# Altium schematic sheet 18650 charge.SchDoc
size A4
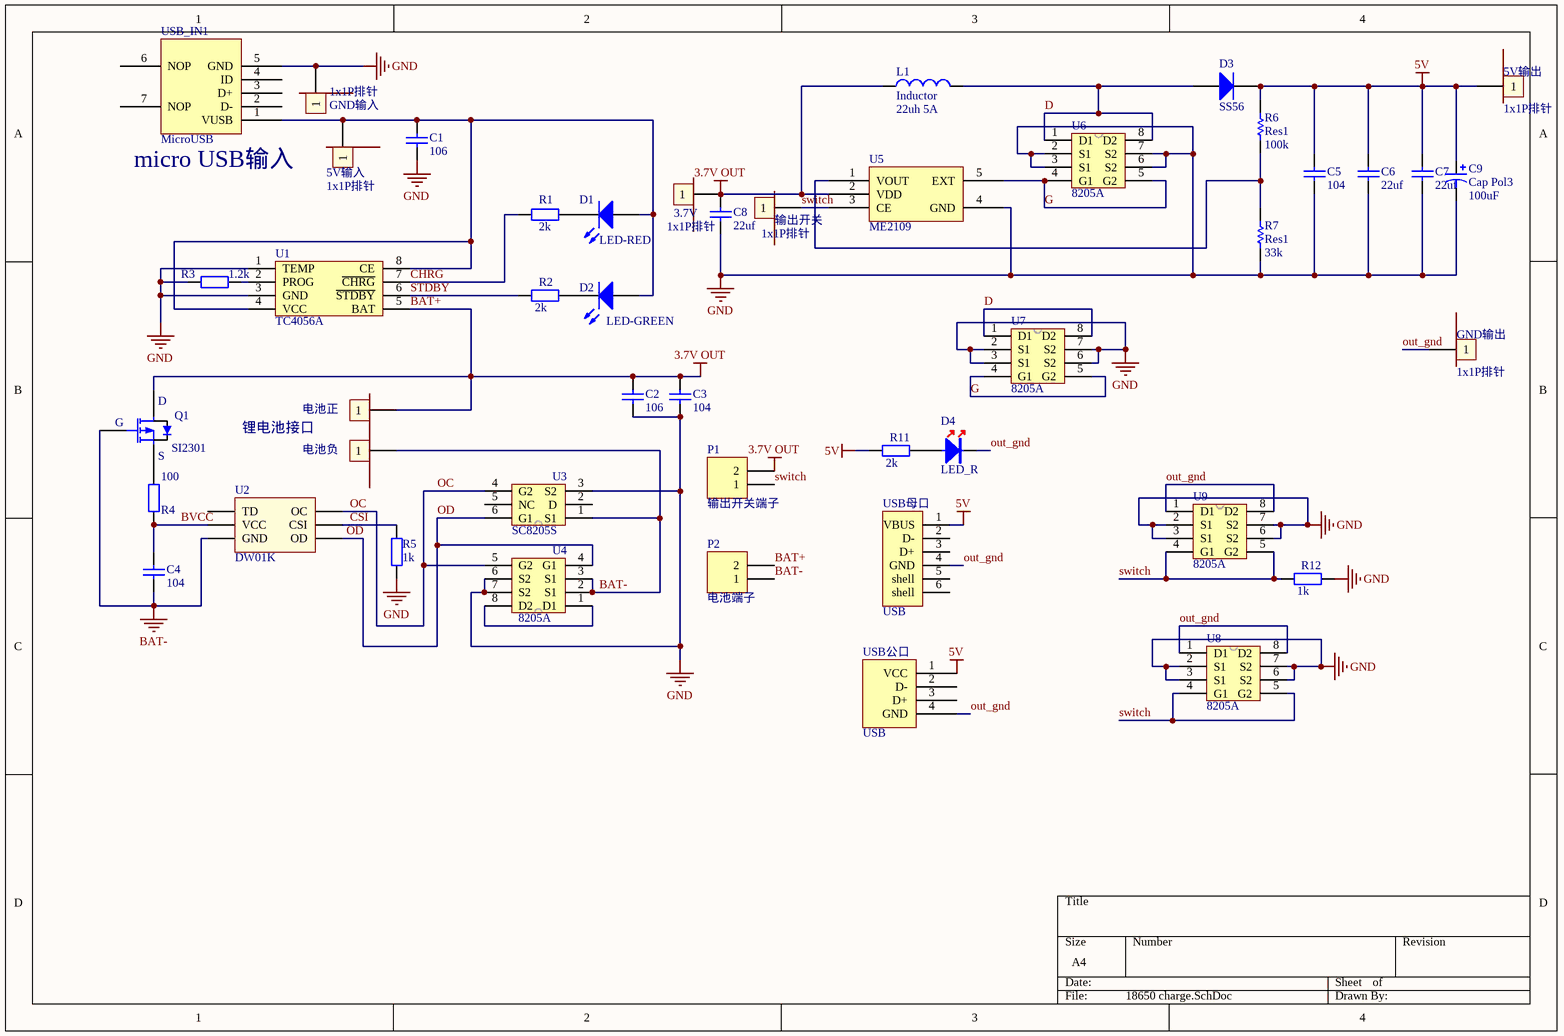
[diagram p0: 18650 charge.SchDoc]

## Parts
3.7V  1x1P排针  [HDR1B]
5V输入  1x1P排针  [HDR1B]
5V输出  1x1P排针  [HDR1B]
C1  106  [0805C]
C2  106  [0805C]
C3  104  [0805C]
C4  104  [0805C]
C5  104  [0805C]
C6  22uf  [0805C]
C7  22uf  [0805C]
C8  22uf  [0805C]
C9  Cap Pol3  value 100uF  [100uf youxin]
D1  LED-RED  [0603LED]
D2  LED-GREEN  [0603LED]
D3  SS56  [SMC(DO-214AB)]
D4  LED_R  [6-0805_M]
GND输入  1x1P排针  [HDR1B]
GND输出  1x1P排针  [HDR1B]
L1  Inductor  value 22uh 5A  [L1110]
P1  输出开关端子  [KF301_2P]
P2  电池端子  [KF301_2P]
Q1  SI2301  [SOT23-3]
R1  2k  [0603R]
R2  2k  [0603R]
R3  1.2k  [0603R]
R4  100  [0603R]
R5  1k  [0603R]
R6  Res1  value 100k  [6-0805_M]
R7  Res1  value 33k  [6-0805_M]
R11  2k  [0603R]
R12  1k  [0603R]
U1  TC4056A  [SOIC8-MP1584EN]
U2  DW01K  [sot23-6]
U3  SC8205S  [sot23-6]
U4  8205A  [Tssop8]
U5  ME2109  [SOT-23-5]
U6  8205A  [Tssop8]
U7  8205A  [Tssop8]
U8  8205A  [Tssop8]
U9  8205A  [Tssop8]
USB_IN1  MicroUSB  [microusb]
USB公口  USB  [USB-M-48]
USB母口  USB  [USB-A]
电池正  (no value)  [HDR1B]
电池负  (no value)  [HDR1B]
输出开关  1x1P排针  [HDR1B]

## Nets
5V: 5V输出.1 C5.2 C6.2 C7.2 C9.1 D3.2(K) R6.2 R11.1 USB公口.1(VCC) USB母口.1(VBUS)
BAT+: 3.7V.1 C2.2 C3.2 C8.2 L1.1 P1.2 P2.2 Q1.3(D) U1.5(BAT) U5.2(VDD) 电池正.1  [also labelled 3.7V OUT]
BAT-: C4.1 P2.1 Q1.1(G) U2.6(GND) U3.1(S1) U4.2(S1) U4.3(S1) 电池负.1
GND: C1.1 C2.1 C3.1 C5.1 C6.1 C7.1 C8.1 C9.2 GND输入.1 R3.1 R5.1 R7.1 R12.2 U1.1(TEMP) U1.3(GND) U3.3(S2) U4.6(S2) U4.7(S2) U5.4(GND) U6.2(S1) U6.3(S1) U6.6(S2) U6.7(S2) U7.2(S1) U7.3(S1) U7.6(S2) U7.7(S2) U8.2(S1) U8.3(S1) U8.6(S2) U8.7(S2) U9.2(S1) U9.3(S1) U9.6(S2) U9.7(S2) USB_IN1.5(GND)
BVCC: C4.2 R4.2 U2.5(VCC)
CHRG: R1.1 U1.7(~{CHRG})
CSI: R5.2 U2.2(CSI)
D: D3.1(A) L1.2 U6.1(D1) U6.8(D2) U7.1(D1) U7.8(D2)
G: U5.5(EXT) U6.4(G1) U6.5(G2) U7.4(G1) U7.5(G2)
OC: U2.3(OC) U3.4(G2) U4.5(G2)
OD: U2.1(OD) U3.6(G1) U4.4(G1)
out_gnd: D4.2 GND输出.1 U8.1(D1) U8.8(D2) U9.1(D1) U9.8(D2) USB公口.4(GND) USB母口.4(GND)
STDBY: R2.1 U1.6(~{STDBY})
switch: P1.1 R12.1 U5.3(CE) U8.4(G1) U8.5(G2) U9.4(G1) U9.5(G2) 输出开关.1
Net5V输入_1: 5V输入.1 C1.2 D1.A D2.A U1.4(VCC) U1.8(CE) USB_IN1.1(VUSB)
NetD1_K: D1.K R1.2
NetD2_K: D2.K R2.2
NetD4_1: D4.1 R11.2
NetQ1_2: Q1.2(S) R4.1
NetR3_2: R3.2 U1.2(PROG)
NetR6_1: R6.1 R7.2 U5.1(VOUT)
NetU4_1: U4.1(D1) U4.8(D2)

Not connected (* = marked no-connect by the designer): U2 4(TD); U3 2(D) 5(NC); USB_IN1 2(D-) 3(D+) 4(ID) 6(NOP) 7(NOP); USB公口 2(D-) 3(D+); USB母口 2(D-) 3(D+) 5(shell) 6(shell)

## Notes on the sheet
- (near USB_IN1) micro USB输入
- 锂电池接口

## Library data of the parts
C1-C8 = 0805电容
C9 = Cap Pol3: Polarized Capacitor (Surface Mount); Published: 8-Jun-2000; LatestRevisionDate: 29-May-2009; LatestRevisionNote: IPC-7351 Footprint Added.; PackageReference: C0805; Publisher: Altium Limited; PackageDescription: Chip Capacitor
D1 D2 = 0603LED
D3 = Diode 1N4001: 1 Amp General Purpose Rectifier; Published: 8-Jun-2000; LatestRevisionDate: 17-Jul-2002; LatestRevisionNote: Re-released for DXP Platform.; DatasheetVersion: 1998; PackageVersion: Aug-1999; PackageReference: DO-41; Publisher: Altium Limited; PackageDescription: Diode, Axial; Body 5.2 x 2.7 mm (LxDia. max), Lead Dia. 0.86 mm (max); Code_JEDEC: DO-204-AL; ComponentLink1Description: Manufacturer Link; ComponentLink1URL: http://www.fairchildsemi.com/; ComponentLink2Description: Datasheet; ComponentLink2URL: http://www.fairchildsemi.com/ds/1N%2F1N4001.pdf
L1 = Inductor: Code_IEC: 1005; Published: 8-Jun-2000; LatestRevisionDate: 29-May-2009; LatestRevisionNote: IPC-7351 Footprint Added.; PackageReference: 0402-A; Publisher: Altium Limited; PackageDescription: Chip Inductor; Code_JEITA: 0402
P1 P2 = Header 2: Header, 2-Pin; LatestRevisionDate: 17-Jul-2002; LatestRevisionNote: Re-released for DXP Platform.; Publisher: Altium Limited
Q1 = MOSP1
R1-R5 R11 R12 = 0603电阻
R6 R7 = Res1: Resistor; Published: 8-Jun-2000; LatestRevisionDate: 17-Jul-2002; LatestRevisionNote: Re-released for DXP Platform.; PackageReference: AXIAL-0.3; Publisher: Altium Limited; PackageDescription: Axial Device, Thru-Hole; 2 Leads; 0.3 in Pin Spacing
U1 = SC_ME4057: SOP8D
U2 = DW01
U3 = 8205S
USB公口 = usb 公口
USB母口 = USB: D
电池正 电池负 = 1x1P排针